# Altium schematic sheet Ethernet.SchDoc: =TITLE
size A3; DocumentNumber: 10; SheetNumber: 10; SheetTotal: 11
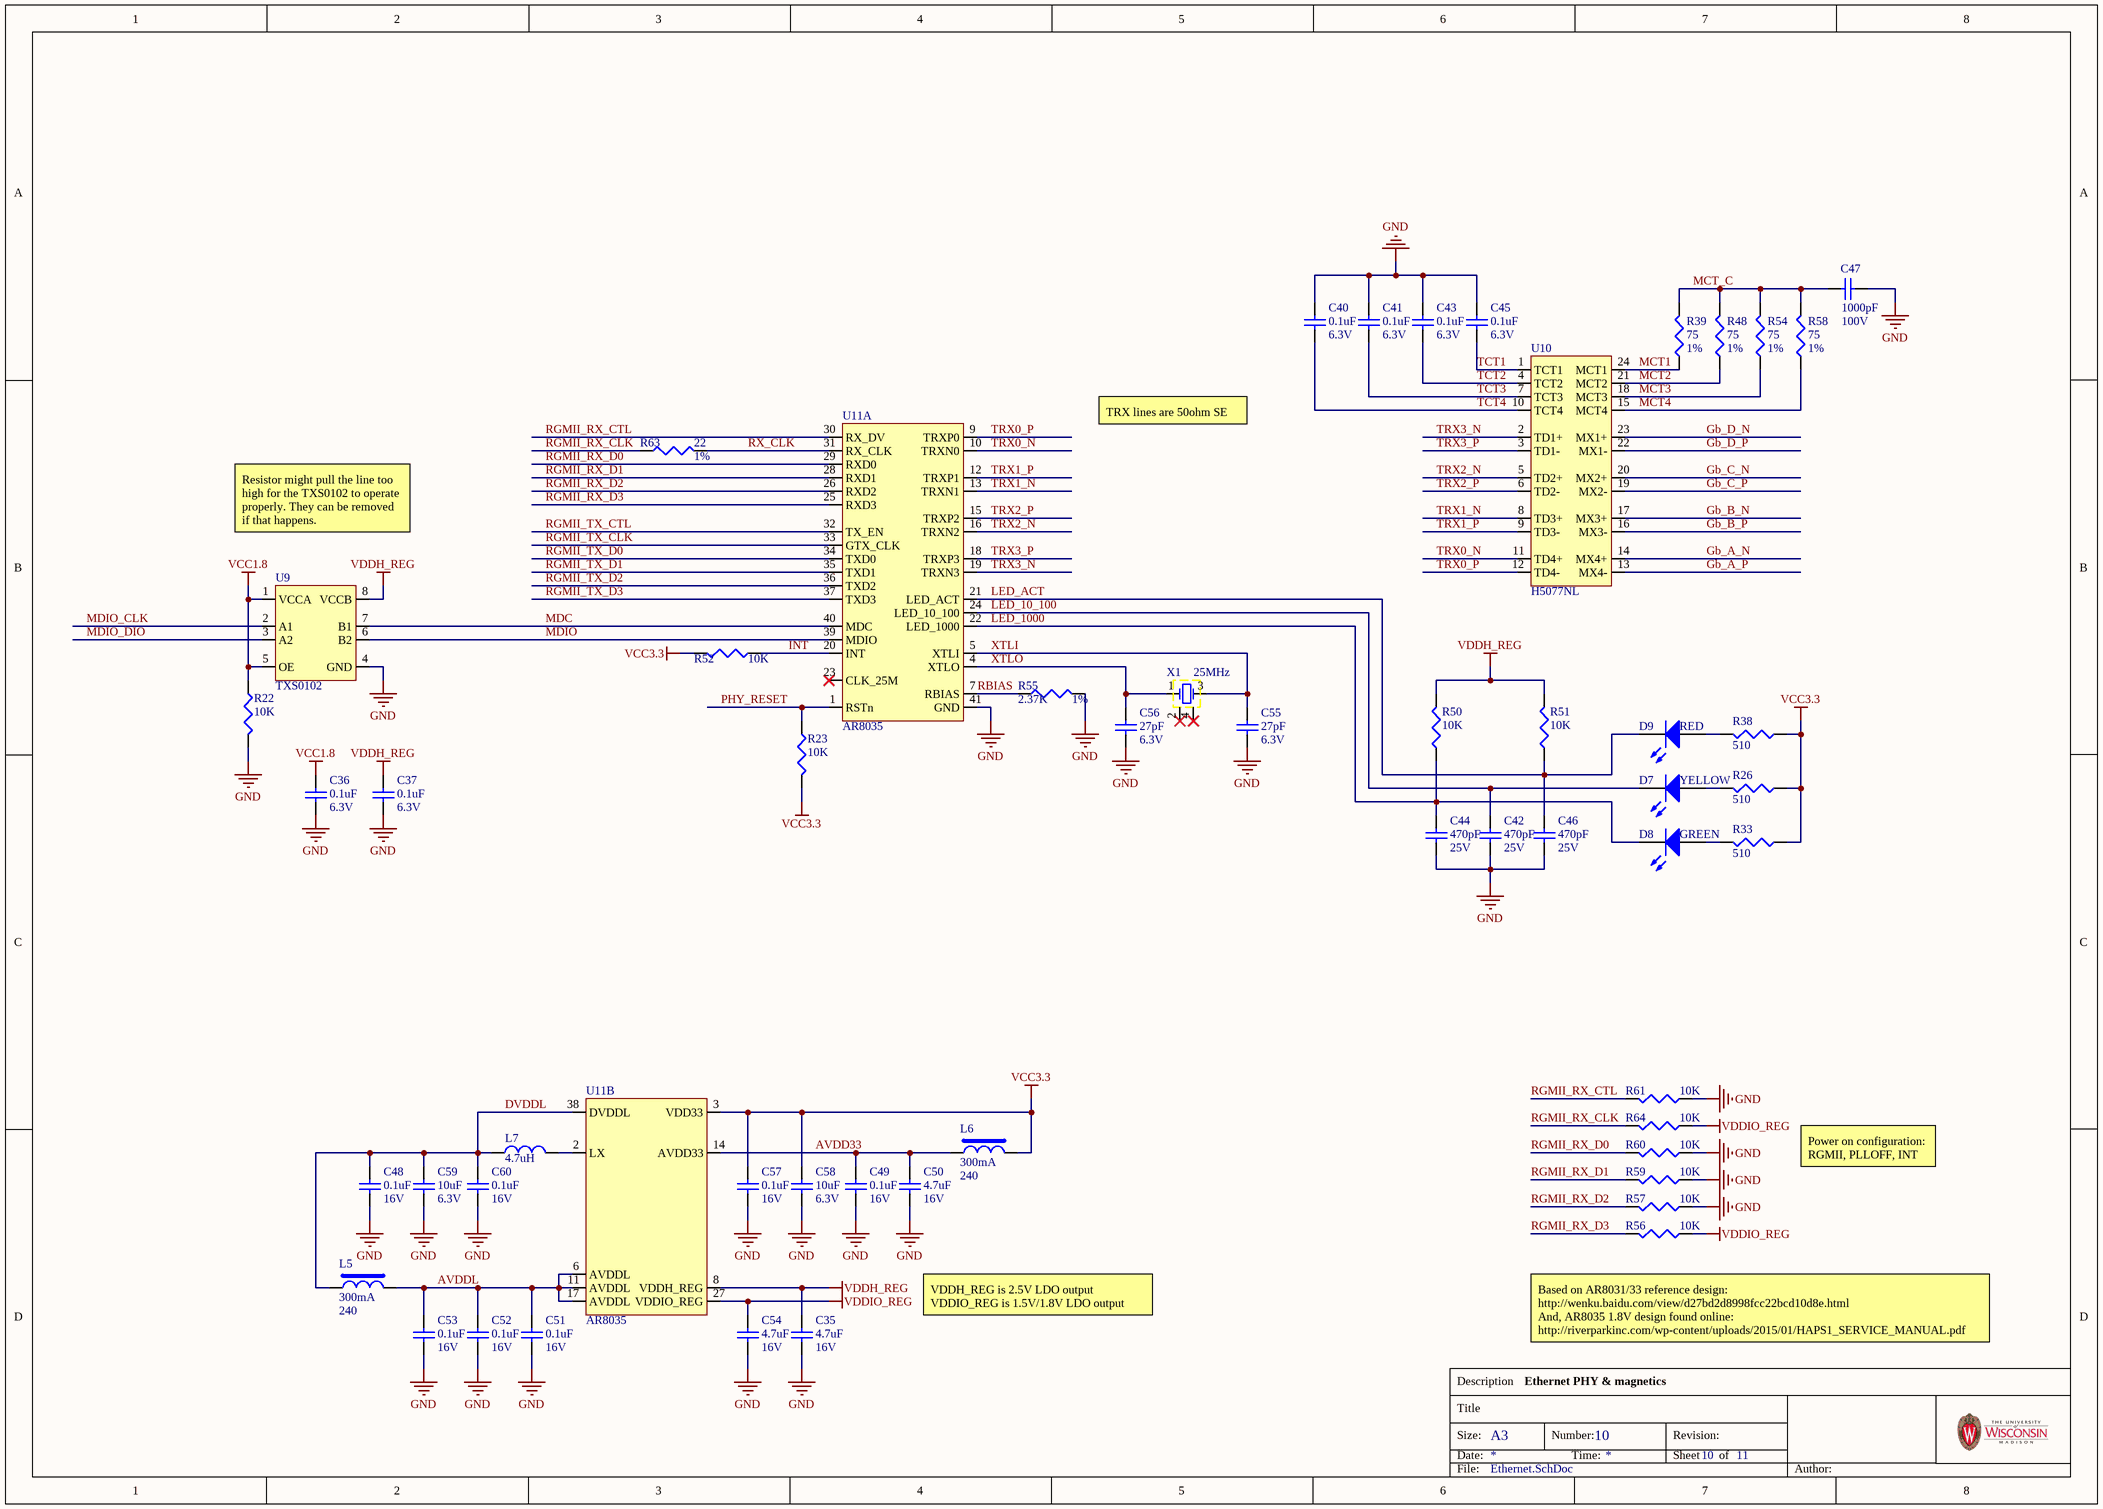
[diagram p0: Ethernet.SchDoc]

## Parts
C35  value 4.7uF  Rating: 16V  [C0402_IPC_H]  (hidden comment: ?)
C36  value 0.1uF  Rating: 6.3V  [C0201_IPC_H]  (hidden comment: ?)
C37  value 0.1uF  Rating: 6.3V  [C0201_IPC_H]  (hidden comment: ?)
C40  value 0.1uF  Rating: 6.3V  [C0201_IPC_H]  (hidden comment: ?)
C41  value 0.1uF  Rating: 6.3V  [C0201_IPC_H]  (hidden comment: ?)
C42  value 470pF  Rating: 25V  [C0201_IPC_H]  (hidden comment: ?)
C43  value 0.1uF  Rating: 6.3V  [C0201_IPC_H]  (hidden comment: ?)
C44  value 470pF  Rating: 25V  [C0201_IPC_H]  (hidden comment: ?)
C45  value 0.1uF  Rating: 6.3V  [C0201_IPC_H]  (hidden comment: ?)
C46  value 470pF  Rating: 25V  [C0201_IPC_H]  (hidden comment: ?)
C47  value 1000pF  Rating: 100V  [C0402_IPC_H]  (hidden comment: ?)
C48  value 0.1uF  Rating: 16V  [C0402_IPC_H]  (hidden comment: ?)
C49  value 0.1uF  Rating: 16V  [C0402_IPC_H]  (hidden comment: ?)
C50  value 4.7uF  Rating: 16V  [C0402_IPC_H]  (hidden comment: ?)
C51  value 0.1uF  Rating: 16V  [C0402_IPC_H]  (hidden comment: ?)
C52  value 0.1uF  Rating: 16V  [C0402_IPC_H]  (hidden comment: ?)
C53  value 0.1uF  Rating: 16V  [C0402_IPC_H]  (hidden comment: ?)
C54  value 4.7uF  Rating: 16V  [C0402_IPC_H]  (hidden comment: ?)
C55  value 27pF  Rating: 6.3V  [C0201_IPC_H]  (hidden comment: ?)
C56  value 27pF  Rating: 6.3V  [C0201_IPC_H]  (hidden comment: ?)
C57  value 0.1uF  Rating: 16V  [C0402_IPC_H]  (hidden comment: ?)
C58  value 10uF  Rating: 6.3V  [C0402_IPC_H]  (hidden comment: ?)
C59  value 10uF  Rating: 6.3V  [C0402_IPC_H]  (hidden comment: ?)
C60  value 0.1uF  Rating: 16V  [C0402_IPC_H]  (hidden comment: ?)
D7  value YELLOW  [LED0603_M]  (hidden comment: ?)
D8  value GREEN  [LED0603_M]  (hidden comment: ?)
D9  value RED  [LED0603_M]  (hidden comment: ?)
L5  value 240  Rated Current: 300mA  [L0402_H]  (hidden comment: BK1005HM241-T)
L6  value 240  Rated Current: 300mA  [L0402_H]  (hidden comment: BK1005HM241-T)
L7  value 4.7uH  [L2520_H]  (hidden comment: Wurth 74438323047)
R22  value 10K  [R0402_IPC_H]  (hidden comment: ?)
R23  value 10K  [R0201_IPC_H]  (hidden comment: ?)
R26  value 510  [R0402_IPC_H]  (hidden comment: ?)
R33  value 510  [R0402_IPC_H]  (hidden comment: ?)
R38  value 510  [R0402_IPC_H]  (hidden comment: ?)
R39  value 75  Tolerance: 1%  [R0402_IPC_H]  (hidden comment: ?)
R48  value 75  Tolerance: 1%  [R0402_IPC_H]  (hidden comment: ?)
R50  value 10K  [R0201_IPC_H]  (hidden comment: ?)
R51  value 10K  [R0201_IPC_H]  (hidden comment: ?)
R52  value 10K  [R0402_IPC_H]  (hidden comment: ?)
R54  value 75  Tolerance: 1%  [R0402_IPC_H]  (hidden comment: ?)
R55  value 2.37K  Tolerance: 1%  [R0402_IPC_H]  (hidden comment: ?)
R56  value 10K  [R0402_IPC_H]  (hidden comment: ?)
R57  value 10K  [R0402_IPC_H]  (hidden comment: ?)
R58  value 75  Tolerance: 1%  [R0402_IPC_H]  (hidden comment: ?)
R59  value 10K  [R0402_IPC_H]  (hidden comment: ?)
R60  value 10K  [R0402_IPC_H]  (hidden comment: ?)
R61  value 10K  [R0402_IPC_H]  (hidden comment: ?)
R63  value 22  Tolerance: 1%  [R0201_IPC_H]  (hidden comment: ?)
R64  value 10K  [R0402_IPC_H]  (hidden comment: ?)
U9  TXS0102  [X2SON-8_H]
U10  H5077NL  [H5077NL]
U11  AR8035  [QFN40_H]  (parts A,B of 2)
X1  value 25MHz  [XRCGB_F]  (hidden comment: XRCGB25M000F3M00R0)

## Nets
GND: C35.1 C36.1 C37.1 C40.2 C41.2 C42.1 C43.2 C44.1 C45.2 C46.1 C47.1 C48.1 C49.1 C50.1 C51.1 C52.1 C53.1 C54.1 C55.1 C56.1 C57.1 C58.1 C59.1 C60.1 R22.2 R55.2 R57.1 R59.1 R60.1 R61.1 U9.4(GND) U11.41(GND)
VCC1.8: C36.2 R22.1 U9.1(VCCA) U9.5(OE)
VCC3.3: C57.2 C58.2 L6.2 R23.2 R26.1 R33.1 R38.1 R52.2 U11.3(VDD33)
VDDH_REG: C35.2 C37.2 R50.2 R51.2 U9.8(VCCB) U11.8(VDDH_REG)
VDDIO_REG: C54.2 R56.1 R64.1 U11.27(VDDIO_REG)
AVDD33: C49.2 C50.2 L6.1 U11.14(AVDD33)
AVDDL: C51.2 C52.2 C53.2 L5.2 U11.6(AVDDL) U11.11(AVDDL) U11.17(AVDDL)
DVDDL: C48.2 C59.2 C60.2 L5.1 L7.1 U11.38(DVDDL)
Gb_A_N: U10.14(MX4+)
Gb_A_P: U10.13(MX4-)
Gb_B_N: U10.17(MX3+)
Gb_B_P: U10.16(MX3-)
Gb_C_N: U10.20(MX2+)
Gb_C_P: U10.19(MX2-)
Gb_D_N: U10.23(MX1+)
Gb_D_P: U10.22(MX1-)
INT: R52.1 U11.20(INT)
LED_10_100: C42.2 D7.2(K) U11.24(LED_10_100)
LED_1000: C44.2 D8.2(K) R50.1 U11.22(LED_1000)
LED_ACT: C46.2 D9.2(K) R51.1 U11.21(LED_ACT)
MCT1: R39.1 U10.24(MCT1)
MCT2: R48.1 U10.21(MCT2)
MCT3: R54.1 U10.18(MCT3)
MCT4: R58.1 U10.15(MCT4)
MCT_C: C47.2 R39.2 R48.2 R54.2 R58.2
MDC: U9.7(B1) U11.40(MDC)
MDIO: U9.6(B2) U11.39(MDIO)
MDIO_CLK: U9.2(A1)
MDIO_DIO: U9.3(A2)
PHY_RESET: R23.1 U11.1(RSTn)
RBIAS: R55.1 U11.7(RBIAS)
RGMII_RX_CLK: R63.1 R64.2
RGMII_RX_CTL: R61.2 U11.30(RX_DV)
RGMII_RX_D0: R60.2 U11.29(RXD0)
RGMII_RX_D1: R59.2 U11.28(RXD1)
RGMII_RX_D2: R57.2 U11.26(RXD2)
RGMII_RX_D3: R56.2 U11.25(RXD3)
RGMII_TX_CLK: U11.33(GTX_CLK)
RGMII_TX_CTL: U11.32(TX_EN)
RGMII_TX_D0: U11.34(TXD0)
RGMII_TX_D1: U11.35(TXD1)
RGMII_TX_D2: U11.36(TXD2)
RGMII_TX_D3: U11.37(TXD3)
RX_CLK: R63.2 U11.31(RX_CLK)
TCT1: C45.1 U10.1(TCT1)
TCT2: C43.1 U10.4(TCT2)
TCT3: C41.1 U10.7(TCT3)
TCT4: C40.1 U10.10(TCT4)
TRX0_N: U10.11(TD4+) U11.10(TRXN0)
TRX0_P: U10.12(TD4-) U11.9(TRXP0)
TRX1_N: U10.8(TD3+) U11.13(TRXN1)
TRX1_P: U10.9(TD3-) U11.12(TRXP1)
TRX2_N: U10.5(TD2+) U11.16(TRXN2)
TRX2_P: U10.6(TD2-) U11.15(TRXP2)
TRX3_N: U10.2(TD1+) U11.19(TRXN3)
TRX3_P: U10.3(TD1-) U11.18(TRXP3)
XTLI: C55.2 U11.5(XTLI) X1.3
XTLO: C56.2 U11.4(XTLO) X1.1
NetD7_1: D7.1(A) R26.2
NetD8_1: D8.1(A) R33.2
NetD9_1: D9.1(A) R38.2
NetL7_2: L7.2 U11.2(LX)

Not connected (* = marked no-connect by the designer): U11 23(CLK_25M)*; X1 2* 4*

## Notes on the sheet
- TRX lines are 50ohm SE
- Resistor might pull the line too high for the TXS0102 to operate properly. They can be removed if that happens.
- Power on configuration:
  RGMII, PLLOFF, INT
- VDDH_REG is 2.5V LDO output
  VDDIO_REG is 1.5V/1.8V LDO output
- Ethernet PHY & magnetics
- (near R56) Based on AR8031/33 reference design:
  http://wenku.baidu.com/view/d27bd2d8998fcc22bcd10d8e.html
  And, AR8035 1.8V design found online:
  http://riverparkinc.com/wp-content/uploads/2015/01/HAPS1_SERVICE_MANUAL.pdf
- Description
- Title
- Size:
- Date:
- A3
- Number:
- Time:
- Revision:
- Sheet
- of
- File:
- Author:

## Library data of the parts
C35 C50 C54 = Cap: Capacitor; Manufacturer: AVX; Part: 0402YD475MAT2A; INVKEY: CP0402-4.7uf-16V-20%; PackageDescription: Chip Capacitor
C36 C37 C40 C41 C43 C45 = Cap: Capacitor; Manufacturer: Murata; Part: GRM033R60J104KE19D; INVKEY: CP0201-0.1UF-6.3V-10%; PackageDescription: Chip Capacitor
C42 C44 C46 = Cap: Capacitor; Manufacturer: TDK; Part: C0603X7R1E471K030BA; INVKEY: CP0201-470PF-25V-10%; PackageDescription: Chip Capacitor
C47 = Cap: Capacitor; Manufacturer: Murata; Part: GRM155R72A102KA01D; INVKEY: CP0402-1000PF-100V-10%; PackageDescription: Chip Capacitor
C48 C49 C51-C53 C57 C60 = Cap: Capacitor; Manufacturer: Murata; Part: GRM155R71C104KA88D; INVKEY: CP0402-0.1UF-16V-10%; PackageDescription: Chip Capacitor
C55 C56 = Cap: Capacitor; Manufacturer: Murata; Part: GJM0335C0J270JB01D; INVKEY: CP0201-27PF-6V3-5%; PackageDescription: Chip Capacitor
C58 C59 = Cap: Capacitor; Manufacturer: Murata; Part: GRM155R60J106ME44D; INVKEY: CP0402-10UF-6V3-20%; PackageDescription: Chip Capacitor
D7 = LED: Light Emitting Diode; Manufacturer: Lite-On; Part: LTST-C190KSKT; INVKEY: LED-YLW-TOP-0603
D8 = LED: Light Emitting Diode; Manufacturer: Lite-On; Part: LTST-C190KGKT; INVKEY: LED-GN-TOP-0603
D9 = LED: Light Emitting Diode; Manufacturer: Lite-On; Part: LTST-C190KRKT; INVKEY: LED-RD-TOP-0603
L5 L6 = Bead: Bead Inductor; Manufacturer: Taiyo Yuden; Measuring Frequency: 100MHz; INVKEY: FB-BK1005HM241-T; PackageDescription: Chip Inductor; Part: BK1005HM241-T
L7 = Ind: Inductor; Tolerance: 20%; DC Resistance: 338mOhm; DC Current: 0.94A; INVKEY: IND-74438323047; PackageDescription: Chip Inductor; Manufacturer: Wurth; Part: 74438323047
R22 R52 R56 R57 R59-R61 R64 = Res: Resistor; Manufacturer: Panasonic-ECG; Part: ERJ-2GEJ103X; Tolerance: 5%; INVKEY: RS0402-10K-1/10W-5%; PackageDescription: Chip Resistor
R23 R50 R51 = Res: Resistor; Manufacturer: Panasonic; Part: ERJ-1GNF1002C; Tolerance: 1%; INVKEY: RS0201-10K-1/20W-1%; PackageDescription: Chip Resistor
R26 R33 R38 = Res: Resistor; Manufacturer: Panasonic-ECG; Part: ERJ-2RKF5100X; Tolerance: 1%; INVKEY: RS0402-510R-1/10W-1%; PackageDescription: Chip Resistor
R39 R48 R54 R58 = Res: Resistor; Manufacturer: Panasonic; Part: ERJ-2RKF75R0X; INVKEY: RS0402-75R-1/10W-1%; PackageDescription: Chip Resistor
R55 = Res: Resistor; Manufacturer: Panasonic; Part: ERJ-2RKF2371X; INVKEY: RS0402-2K37-1/10W-1%; PackageDescription: Chip Resistor
R63 = Res: Resistor; Manufacturer: Panasonic; Part: ERJ-1GNF22R0C; INVKEY: RS0201-22R-1/20W-1%; PackageDescription: Chip Resistor
U9 = TXS0102: 2-Bit Bidirectional Voltage-Level Translator for Open-Drain and Push-Pull Applications; Manufacturer: Texas Instruments; Part: TXS0102DQER; INVKEY: IC-TXS0102DQER
U10 = H5077NL: 1000Base-T, Single Port Mini-Magnetics Modules; Manufacturer: Pulse Electronics; INVKEY: IC-XFRM-MINIMAG-1000BASE-T; Part: H5077NL
U11 = AR8035: Integrated 10/100/1000 Gigabit Ethernet Transceiver; Manufacturer: Atheros; INVKEY: IC-TXRX-AR8035; Part: AR8035
X1 = Crystal Osc: Standard Crystal Oscillator; Manufacturer: Murata; INVKEY: CRY-XRCGB-25.0000MHZ; Part: XRCGB25M000F3M00R0